# EAGLE schematic multiple_tile (EAGLE 6.6.0)
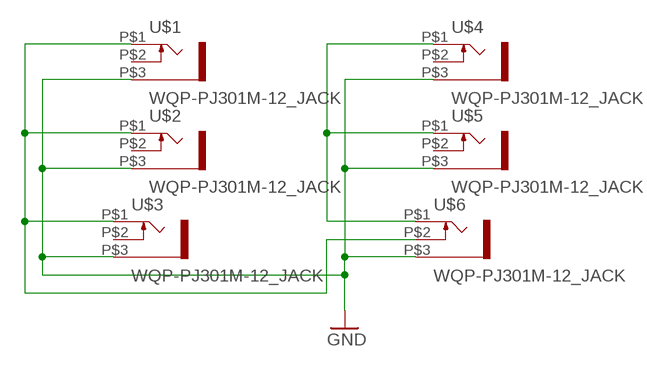
[diagram p0: schematic, sheet 1]

## Parts
U$1  WQP-PJ301M-12_JACK  [WQP-PJ301M-12_JACK]
U$2  WQP-PJ301M-12_JACK  [WQP-PJ301M-12_JACK]
U$3  WQP-PJ301M-12_JACK  [WQP-PJ301M-12_JACK]
U$4  WQP-PJ301M-12_JACK  [WQP-PJ301M-12_JACK]
U$5  WQP-PJ301M-12_JACK  [WQP-PJ301M-12_JACK]
U$6  WQP-PJ301M-12_JACK  [WQP-PJ301M-12_JACK]

## Nets
GND: U$1.P$3 U$2.P$3 U$3.P$3 U$4.P$3 U$5.P$3 U$6.P$3
SIG1: U$1.P$1 U$2.P$1 U$3.P$1 U$6.P$2
SIG2: U$4.P$1 U$5.P$1 U$6.P$1
Unconnected: U$1.P$2 U$2.P$2 U$3.P$2 U$4.P$2 U$5.P$2

## Library data of the parts
U$1-U$6 = thonkiconn:WQP-PJ301M-12_JACK